# EasyEDA schematic OCC Detect LM339.json
TITLE: OCC-Detect-LM339; REV: 1.0; Date: 2026-05-20; Sheet: 1/1; Drawn By: helmut-f; Company: Your Company
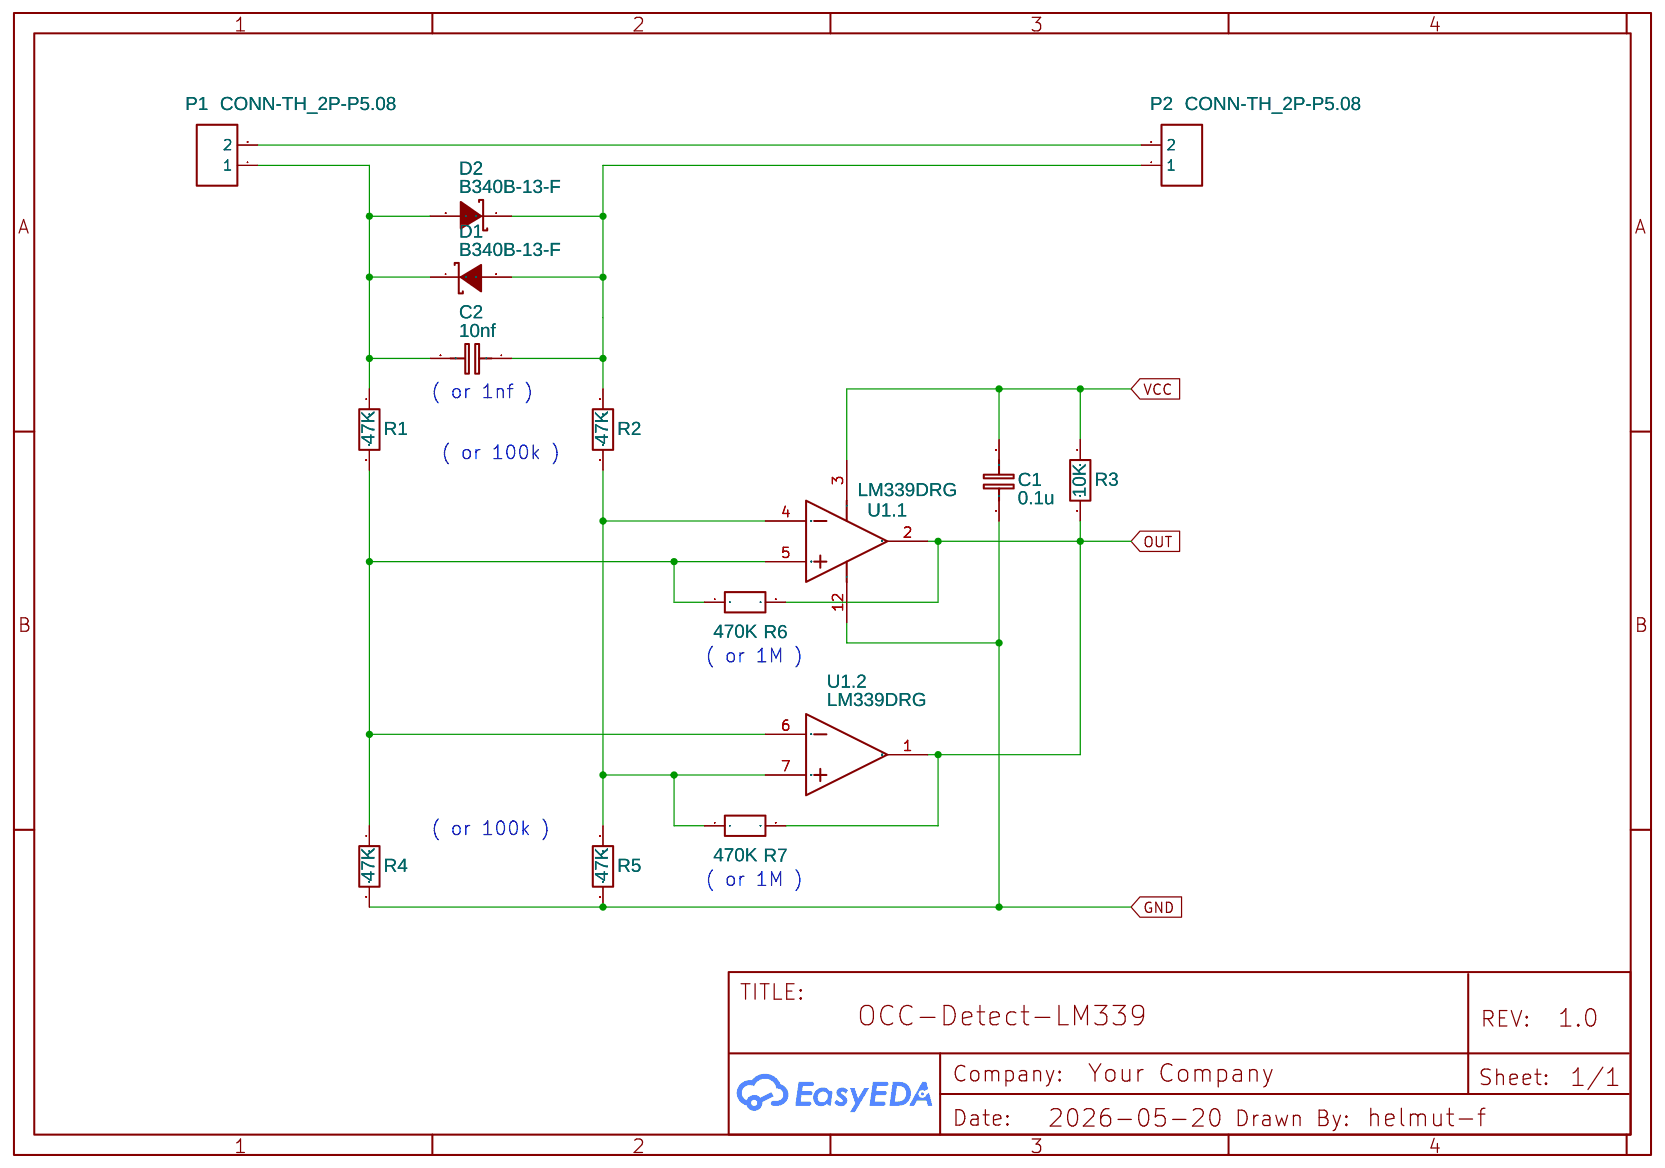
[diagram p0: schematic sheet]

## Parts
C1  0.1u  [C1206]
C2  10nf  [C1206]
D1  B340B-13-F  [SMB_L4.6-W3.6-LS5.3-RD]
D2  B340B-13-F  [SMB_L4.6-W3.6-LS5.3-RD]
P1  CONN-TH_2P-P5.08  [CONN-TH_2P-P5.08]
P2  CONN-TH_2P-P5.08  [CONN-TH_2P-P5.08]
R1  47K  [R1206]
R2  47K  [R1206]
R3  10K  [R1206]
R4  47K  [R1206]
R5  47K  [R1206]
R6  470K  [R1206]
R7  470K  [R1206]
U1  LM339DRG  [SOP-14_L8.7-W3.9-P1.27-LS6.0-BL]  (sections 1,2)

## Library data of the parts
C1 C2 = C_1206_EU: Contributor: LCEDA_Lib
D1 D2 = B340B-13-F: Supplier: LCSC; Manufacturer: DIODES(美台); Supplier Part: C85099; JLCPCB Part Class: Extended Part
P1 P2 = CONN-TH_2P-P5.08: Supplier: LCSC; Contributor: LCEDA_Lib
R1-R7 = R_1206_EU: Contributor: LCEDA_Lib
U1 = LM339DRG: Supplier: LCSC; Supplier Part: C19723731; Manufacturer: HGC(深圳汉芯); JLCPCB Part Class: Extended Part; subpart_no: 1

## Nets
GND: C1.1 R4.2 R5.2 U1.12(V-)
VCC: C1.2 R3.1 U1.3(V+)
OUT: R3.2 R6.2 R7.2 U1.1(OUT2) U1.2(OUT1)
Net-(C2-1): C2.1 D1.2(A) D2.1(K) P2.1 R2.1
Net-(C2-2): C2.2 D1.1(K) D2.2(A) P1.1 R1.1
Net-(P1-2): P1.2 P2.2
Net-(R1-2): R1.2 R4.1 R6.1 U1.5(IN1+) U1.6(IN2-)
Net-(R2-2): R2.2 R5.1 R7.1 U1.4(IN1-) U1.7(IN2+)

## Notes on the sheet
- ( or 1nf )
- ( or 100k )
- ( or 1M )
- ( or 100k )
- ( or 1M )
